# Altium project Control_Board_Model_C204.PrjPcb (part 1 of 2)
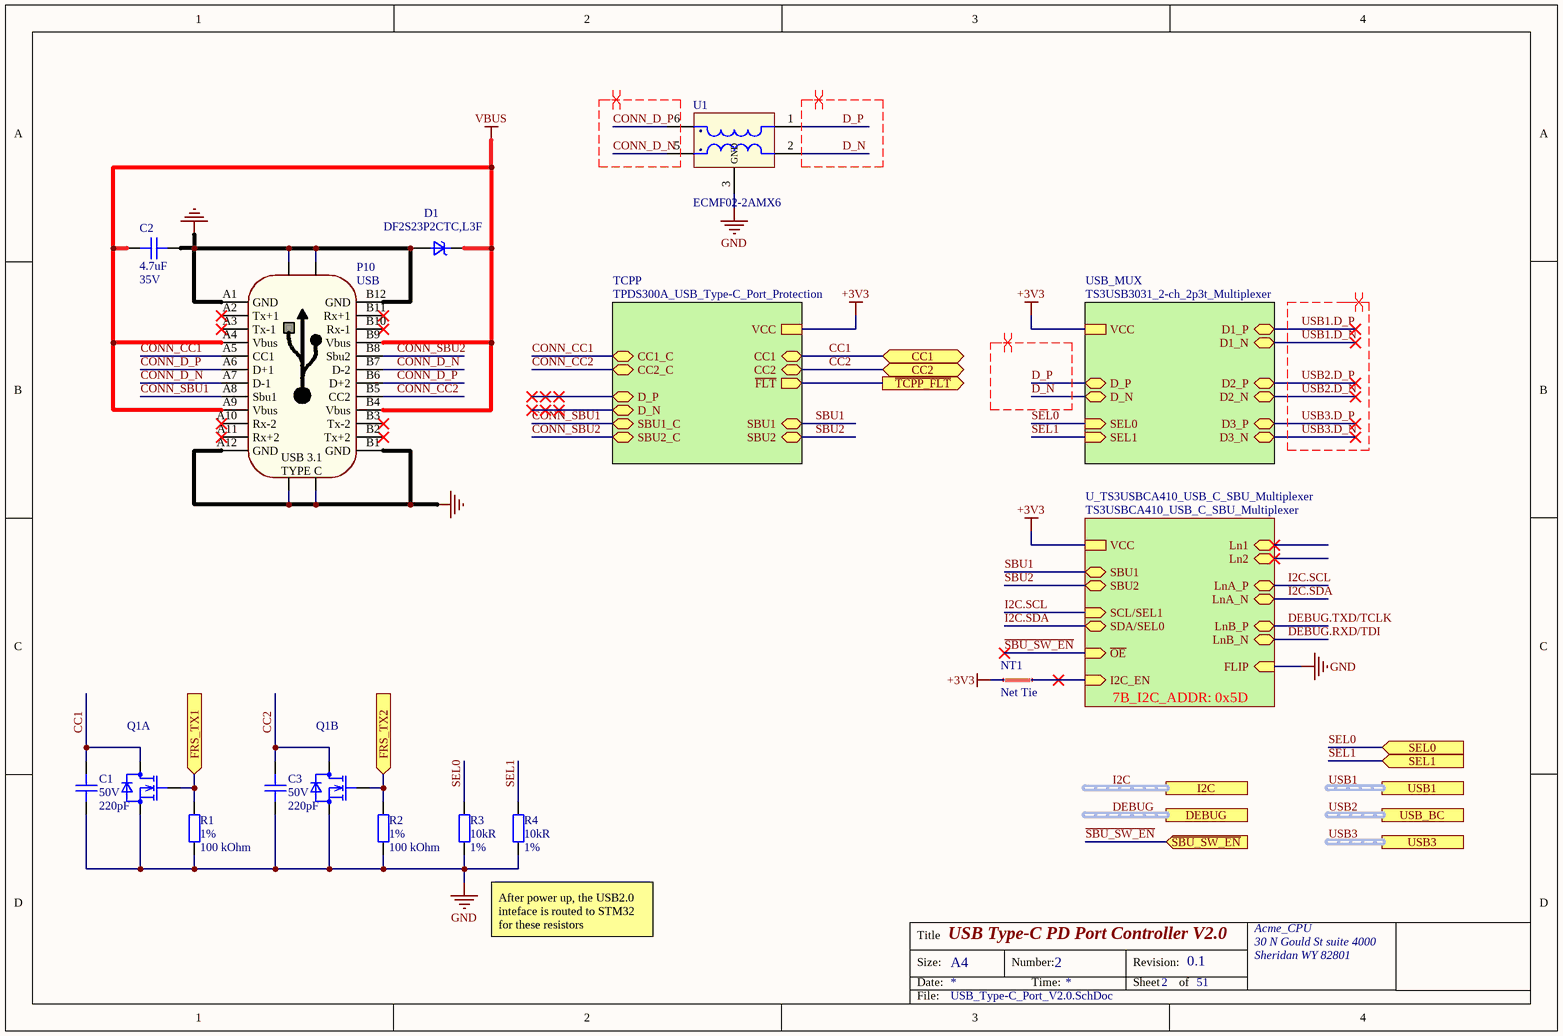
[diagram p0: USB_Type-C_Port_V2.0.SchDoc]
_address1: 30 N Gould St suite 4000; _address2: Sheridan WY 82801; _ApprovedBy: PGU; _BoardName: Control_Board; _CompanyName: Acme_CPU; _DateCode: 2022.12; _DocumentDate: 20220203; _HWEngineer: SGU; _PCBModel: C204; _PCBNumber: 001; _Revision: 0.1; _Title: Control_Board
6 sheets, 66 parts. Net scope: hierarchical (ports join the sheet entries above them; power ports are global).
Board file: Control_Board_Model_C204.PcbDoc
Sheets:
  USB_Type-C_Port_V2.0.SchDoc
  Sensor Connection.SchDoc
    TLT_SENS = BMI270_IMU.SchDoc
  Audio_Module.SchDoc
  Test_Points.SchDoc
  Analog_Signal_Conditioner_V2.SchDoc

## Sheet USB_Type-C_Port_V2.0.SchDoc: USB Type-C PD Port Controller V2.0
size A4; DocumentNumber: 2; SheetNumber: 2; SheetTotal: 51

### Parts
C1  Voltage Rating: 50V  Capacitance: 220pF  [C0402]  (hidden comment: CAP CER 220PF 50V X7R 0402)
C2  Capacitance: 4.7uF  Voltage Rating: 35V  [C0805]  (hidden comment: CAP CER 4.7UF 35V X7R 0805)
C3  Voltage Rating: 50V  Capacitance: 220pF  [C0402]  (hidden comment: CAP CER 220PF 50V X7R 0402)
D1  DF2S23P2CTC,L3F  [CST2C]
NT1  Net Tie  [Net Tie 6x30mil]  (net tie, no BOM)
P10  USB  [MOLEX_2012670005]
Q1  DMN32D2LV-7  [SON_400UV-7_DIO]  (value not drawn)  (parts A,B of 2)
R1  Tolerance: 1%  Resistance: 100 kOhm  [R0402]  (hidden comment: RES SMD 100K OHM 1% 1/16W 0402)
R2  Tolerance: 1%  Resistance: 100 kOhm  [R0402]  (hidden comment: RES SMD 100K OHM 1% 1/16W 0402)
R3  Resistance: 10kR  Tolerance: 1%  [R0402]  (hidden comment: RES SMD 10K OHM 1% 1/16W 0402)
R4  Resistance: 10kR  Tolerance: 1%  [R0402]  (hidden comment: RES SMD 10K OHM 1% 1/16W 0402)
U1  ECMF02-2AMX6  [QFN-6L]

### Sub-sheets
TCPP = TPDS300A_USB_Type-C_Port_Protection (file not in this document): ~{FLT} (out), VCC, CC1 (bidir), CC2 (bidir), CC1_C (bidir), CC2_C (bidir), SBU1_C (bidir), SBU2_C (bidir), SBU1 (bidir), SBU2 (bidir), D_P (bidir), D_N (bidir)
U_TS3USBCA410_USB_C_SBU_Multiplexer = TS3USBCA410_USB_C_SBU_Multiplexer (file not in this document): LnB_P (bidir), LnB_N (bidir), LnA_P (bidir), VCC, Ln1 (bidir), Ln2 (bidir), SBU1 (bidir), SBU2 (bidir), LnA_N (bidir), SCL/SEL1 (in), I2C_EN (in), FLIP (in), SDA/SEL0 (bidir), ~{OE} (in)  | 7B_I2C_ADDR: 0x5D
USB_MUX = TS3USB3031_2-ch_2p3t_Multiplexer (file not in this document): VCC, D_P (bidir), D_N (bidir), D1_N (bidir), D1_P (bidir), D2_P (bidir), D2_N (bidir), D3_N (bidir), D3_P (bidir), SEL0 (in), SEL1 (in)

### Ports
CC1 (bidir), CC2 (bidir), DEBUG (harness DEBUG), FRS_TX1 (in), FRS_TX2 (in), I2C (harness I2C), SEL0 (in), SEL1 (in), USB1 (harness USB), USB3 (harness USB), USB_BC (harness USB), ~{SBU_SW_EN} (in), ~{TCPP_FLT} (out)

### Nets
+3V3: NT1.1 ; sheet USB_MUX/VCC, sheet U_TS3USBCA410_USB_C_SBU_Multiplexer/VCC, sheet TCPP/VCC
GND: C1.1 C2.2 C3.1 D1.2(A) P10.A1(GND) P10.A12(GND) P10.B1(GND) P10.B12(GND) P10.S1 P10.S2 P10.S3 P10.S4 Q1.1(S) Q1.4(S) R1.1 R2.1 R3.2 R4.2 U1.3(GND) ; sheet U_TS3USBCA410_USB_C_SBU_Multiplexer/FLIP
VBUS: C2.1 D1.1(K) P10.A4(Vbus) P10.A9(Vbus) P10.B4(Vbus) P10.B9(Vbus)
~{SBU_SW_EN}: port ~{SBU_SW_EN}, sheet U_TS3USBCA410_USB_C_SBU_Multiplexer/~{OE}
CC1: C1.2 Q1.6(D) ; port CC1, sheet TCPP/CC1
CC2: C3.2 Q1.3(D) ; port CC2, sheet TCPP/CC2
CONN_CC1: P10.A5(CC1) ; sheet TCPP/CC1_C
CONN_CC2: P10.B5(CC2) ; sheet TCPP/CC2_C
CONN_D_N: P10.A7(D-1) P10.B7(D-2) U1.5(OUT2)
CONN_D_P: P10.A6(D+1) P10.B6(D+2) U1.6(OUT1)
CONN_SBU1: P10.A8(Sbu1) ; sheet TCPP/SBU1_C
CONN_SBU2: P10.B8(Sbu2) ; sheet TCPP/SBU2_C
D_N: U1.2(INP2) ; sheet USB_MUX/D_N
D_P: U1.1(INP1) ; sheet USB_MUX/D_P
DEBUG.RXD/TDI: sheet U_TS3USBCA410_USB_C_SBU_Multiplexer/LnB_N
DEBUG.TXD/TCLK: sheet U_TS3USBCA410_USB_C_SBU_Multiplexer/LnB_P
I2C.SCL: sheet U_TS3USBCA410_USB_C_SBU_Multiplexer/LnA_P, sheet U_TS3USBCA410_USB_C_SBU_Multiplexer/SCL/SEL1
I2C.SDA: sheet U_TS3USBCA410_USB_C_SBU_Multiplexer/LnA_N, sheet U_TS3USBCA410_USB_C_SBU_Multiplexer/SDA/SEL0
SBU1: sheet U_TS3USBCA410_USB_C_SBU_Multiplexer/SBU1, sheet TCPP/SBU1
SBU2: sheet U_TS3USBCA410_USB_C_SBU_Multiplexer/SBU2, sheet TCPP/SBU2
SEL0: R3.1 ; port SEL0, sheet USB_MUX/SEL0
SEL1: R4.1 ; port SEL1, sheet USB_MUX/SEL1
USB1.D_N: sheet USB_MUX/D1_N
USB1.D_P: sheet USB_MUX/D1_P
USB2.D_N: sheet USB_MUX/D2_N
USB2.D_P: sheet USB_MUX/D2_P
USB3.D_N: sheet USB_MUX/D3_N
USB3.D_P: sheet USB_MUX/D3_P
NetNT1_2: NT1.2 ; sheet U_TS3USBCA410_USB_C_SBU_Multiplexer/I2C_EN
NetQ1_2: Q1.2(G) R1.2 ; port FRS_TX1
NetQ1_5: Q1.5(G) R2.2 ; port FRS_TX2
(unnamed): port ~{TCPP_FLT}, sheet TCPP/~{FLT}

Not connected (* = marked no-connect by the designer): P10 A2(Tx+1)* A3(Tx-1)* A10(Rx-2)* A11(Rx+2)* B2(Tx+2)* B3(Tx-2)* B10(Rx-1)* B11(Rx+1)*; U1 4(NC)

### Buses and harness runs
harness DEBUG = port DEBUG
harness I2C = port I2C
harness USB1 = port USB1
harness USB2 = port USB_BC
harness USB3 = port USB3

### Layout directives
differential pair: CONN_D_N, CONN_D_P, D_N, D_P, USB1.D_N, USB1.D_P, USB2.D_N, USB2.D_P, USB3.D_N, USB3.D_P

### Notes on the sheet
- After power up, the USB2.0 inteface is routed to STM32 for these resistors
- Title
- Size:
- Date:
- A4
- Number:
- Time:
- Revision:
- Sheet
- of
- File:
- (in symbol CONN 2012670005 RCP USB3.1 TYPEC 24P SMD RA) USB 3.1; TYPE C

### Library data of the parts
C1 C3 = CAP CER 220PF 50V X7R 0402: 220pF ±10% 50V Ceramic Capacitor X7R 0402 (1005 Metric); Manufacturer: Yageo; Manufacturer Part Number: CC0402KRX7R9BB221; Insulation Resistance: 100GR; Supplier 1: Digi-Key; Stock 1: 91221; Pricing 1: 1=0.1, 10=0.026, 50=0.014, 100=0.0114, 500=0.0081, 1000=0.0064, 2500=0.0058, 5000=0.0053 (USD); Mount: Surface Mount; Case/Package: 0402; Weight: 2.3E-05oz; Case Code (Metric): 1005; Case Code (Imperial): 0402; Min Operating Temperature: -55°C; Max Operating Temperature: 125°C; Tolerance: 10%; Packaging: Tape and Reel; Package Quantity: 1; Voltage Rating (DC): 50V; Dielectric: X7R; Termination: SMD/SMT; Composition: Ceramic; Length: 1mm; Height: 0.5mm; Width: 0.02inch; Thickness: 0.022inch; Depth: 0.5mm; REACH SVHC: No SVHC; Lead Free: Lead Free; ComponentLink1URL: http://www.yageo.com/documents/recent/UPY-GPHC_X7R_6.3V-to-50V_18.pdf?src-supplier=Digi-Key; ComponentLink1Description: http://www.yageo.com/documents/recent/UPY-GPHC_X7R_6.3V-to-50V_18.pdf?src-supplier=Digi-Key; ComponentLink2URL: http://www.farnell.com/datasheets/2167236.pdf?src-supplier=Farnell; ComponentLink2Description: http://www.farnell.com/datasheets/2167236.pdf?src-supplier=Farnell; ComponentLink3URL: http://www.yageo.com/documents/recent/UPY-GPHC_X7R_6.3V-to-50V_8.pdf?src-supplier=Avnet; ComponentLink3Description: http://www.yageo.com/documents/recent/UPY-GPHC_X7R_6.3V-to-50V_8.pdf?src-supplier=Avnet; ComponentLink4URL: http://www.farnell.com/datasheets/1489800.pdf?src-supplier=Element14; ComponentLink4Description: http://www.farnell.com/datasheets/1489800.pdf?src-supplier=Element14; ComponentLink5URL: http://www.mouser.com/ds/2/447/Yageo_UPY-GP_NP0_16V-to-50V_9-358835.pdf?src-supplier=Mouser; ComponentLink5Description: http://www.mouser.com/ds/2/447/Yageo_UPY-GP_NP0_16V-to-50V_9-358835.pdf?src-supplier=Mouser; Supplier Part Number 1: 311-1035-1-ND; Number of Pins: 2; Dielectric Material: Ceramic; Radiation Hardening: No; Halogen Free: Halogen Free; ComponentLink6URL: https://www.verical.com/server-webapp/html/getDatasheet?partID=403476&src-supplier=Verical; ComponentLink6Description: https://www.verical.com/server-webapp/html/getDatasheet?partID=403476&src-supplier=Verical; ComponentLink7URL: http://www.yageo.com/documents/recent/UPY-GPHC_X7R_6.3V-to-50V_8.pdf?src-supplier=Avnet+Europe; ComponentLink7Description: http://www.yageo.com/documents/recent/UPY-GPHC_X7R_6.3V-to-50V_8.pdf?src-supplier=Avnet+Europe; ClassName: TCPP
C2 = CAP CER 4.7UF 35V X7R 0805: Manufacturer: TDK; Manufacturer Part Number: C2012X7R1V475K125AC; Dielectric Material: Ceramic; Tolerance: 10%; Supplier 1: Digi-Key; Stock 1: 109602; Pricing 1: 1=0.73, 10=0.519, 50=0.3752, 100=0.3416, 500=0.253, 1000=0.2151 (USD); Mount: Surface Mount; Case/Package: 0805; Weight: 0.000194oz; Case Code (Metric): 2012; Case Code (Imperial): 0805; Min Operating Temperature: -55°C; Max Operating Temperature: 125°C; Packaging: Tape and Reel; Package Quantity: 2000; Dielectric: X7R; Termination: SMD/SMT; Voltage Rating (DC): 35V; Length: 2mm; Height: 1.25mm; Width: 0.049inch; Thickness: 0.057inch; Depth: 1.25mm; Radiation Hardening: No; REACH SVHC: No SVHC; Lead Free: Lead Free; ComponentLink1URL: http://www.farnell.com/datasheets/2792994.pdf?src-supplier=Element14; ComponentLink1Description: http://www.farnell.com/datasheets/2792994.pdf?src-supplier=Element14; ComponentLink2URL: https://product.tdk.com/info/en/catalog/datasheets/mlcc_commercial_general_en.pdf?src-supplier=Digi-Key; ComponentLink2Description: https://product.tdk.com/info/en/catalog/datasheets/mlcc_commercial_general_en.pdf?src-supplier=Digi-Key; ComponentLink3URL: https://product.tdk.com/info/en/catalog/spec/mlccspec_commercial_general_midvoltage_en.pdf?src-supplier=Digi-Key; ComponentLink3Description: https://product.tdk.com/info/en/catalog/spec/mlccspec_commercial_general_midvoltage_en.pdf?src-supplier=Digi-Key; Supplier Part Number 1: 445-7555-1-ND
D1 = TVS DIODE 21VWM 35.7VC CST2C: 35.7V Clamp 14A (8/20µs) Ipp Tvs Diode Surface Mount CST2C; Manufacturer: Toshiba Semiconductor and Storage; Number of Unidirectional Channels: 1; Reverse Standoff Voltage: 21V; Min Breakdown Voltage: 21.5V; Peak Pulse Power: 500W; Power Line Protection: No; Supplier 1: Digi-Key; Manufacturer Part Number: DF2S23P2CTC,L3F; Stock 1: 12413; Mount: Surface Mount; Case/Package: 1610; Number of Pins: 2; Min Operating Temperature: -55°C; Max Operating Temperature: 150°C; Composition: Zener; Packaging: Tape and Reel; Clamping Voltage: 35.7V; Peak Pulse Current: 14A; ComponentLink1URL: https://www.digikey.com/en/products/detail/toshiba-semiconductor-and-storage/DF2S23P2CTC-L3F/10313036; ComponentLink1Description: https://www.digikey.com/en/products/detail/toshiba-semiconductor-and-storage/DF2S23P2CTC-L3F/10313036; Supplier Part Number 1: DF2S23P2CTCL3FTR-ND
NT1 = Net Tie Line: ClassName: Net Tie
P10 = CONN 2012670005 RCP USB3.1 TYPEC 24P SMD RA: USB-C (USB TYPE-C) USB 3.2 Gen 2 (USB 3.1 Gen 2, Superspeed + (USB 3.1)) Receptacle Connector 24 Position Surface Mount, Right Angle; Through Hole; Manufacturer: Molex; Manufacturer Part Number: 201267-0005; Number of Contacts: 24; Number of Ports: 1; Current Rating: 5A; Voltage Rating: 30V; Mating Cycles: 20000; Shielding: Shielded; Supplier 1: Digi-Key; Stock 1: 2580; Pricing 1: 1=2.34, 10=1.997, 100=1.6496 (USD); Mount: Surface Mount,Through Hole; Packaging: Tape and Reel; Connector Type: USB; Gender: Receptacle; ComponentLink1URL: https://www.molex.com/pdm_docs/sd/2012670005_sd.pdf?src-supplier=Digi-Key; ComponentLink1Description: https://www.molex.com/pdm_docs/sd/2012670005_sd.pdf?src-supplier=Digi-Key; ComponentLink2URL: http://www.farnell.com/datasheets/2722545.pdf?src-supplier=Element14; ComponentLink2Description: http://www.farnell.com/datasheets/2722545.pdf?src-supplier=Element14; Supplier Part Number 1: WM17992CT-ND; Contact Plating: Gold; Insulation Color: Black; Min Operating Temperature: -40°C; Max Operating Temperature: 105°C; Termination: Solder; Flammability Rating: UL94 V-0; ComponentLink3URL: http://www.farnell.com/datasheets/2722545.pdf?src-supplier=Newark; ComponentLink3Description: http://www.farnell.com/datasheets/2722545.pdf?src-supplier=Newark; ComponentLink4URL: https://www.molex.com/pdm_docs/pk/2012670005-PK1.pdf?src-supplier=Digi-Key; ComponentLink4Description: https://www.molex.com/pdm_docs/pk/2012670005-PK1.pdf?src-supplier=Digi-Key; ComponentLink5URL: http://www.farnell.com/datasheets/2722545.pdf?src-supplier=Farnell; ComponentLink5Description: http://www.farnell.com/datasheets/2722545.pdf?src-supplier=Farnell
Q1 = ARRAY MOSFET 2N-CH 30V 0.4A SOT-563: Mosfet Array 2 N-Channel (Dual) 30V 400mA 400mW Surface Mount SOT-563; Manufacturer: Diodes; Gate to Source Voltage (Vgs): 10V; Rds On Max: 1.2R; Input Capacitance: 39pF; Number of Channels: 2; Supplier 1: Digi-Key; Manufacturer Part Number: DMN32D2LV-7; Stock 1: 141366; Pricing 1: 1=0.39, 10=0.338, 25=0.3152, 100=0.234, 500=0.1827, 1000=0.1485 (USD); Mount: Surface Mount; Min Operating Temperature: -55°C; Max Operating Temperature: 150°C; Continuous Drain Current (ID): 400mA; Package Quantity: 3000; Packaging: Tape and Reel; Drain to Source Voltage (Vdss): 30V; Max Power Dissipation: 400mW; Drain to Source Breakdown Voltage: 30V; Drain to Source Resistance: 1.2R; Element Configuration: Dual; FET Type: 2 N-Channel; Length: 1.6mm; Height: 0.6mm; Width: 1.2mm; Radiation Hardening: No; REACH SVHC: No SVHC; ComponentLink1URL: https://www.diodes.com/assets/Datasheets/ds31121.pdf?src-supplier=Digi-Key; ComponentLink1Description: https://www.diodes.com/assets/Datasheets/ds31121.pdf?src-supplier=Digi-Key; ComponentLink2URL: http://www.mouser.com/ds/2/115/ds31121-89496.pdf?src-supplier=Mouser; ComponentLink2Description: http://www.mouser.com/ds/2/115/ds31121-89496.pdf?src-supplier=Mouser; ComponentLink3URL: http://www.diodes.com///datasheets/ds31121.pdf?src-supplier=Avnet; ComponentLink3Description: http://www.diodes.com///datasheets/ds31121.pdf?src-supplier=Avnet; Supplier Part Number 1: DMN32D2LV-7DICT-ND; Case/Package: SOT-563; Weight: 0.000106oz; Polarity: N-CHANNEL; Series: -; ClassName: TCPP
R1 R2 = RES SMD 100K OHM 1% 1/16W 0402: 100 kOhms ±1% 0.063W, 1/16W Chip Resistor 0402 (1005 Metric) Moisture Resistant Thick Film; Manufacturer: Yageo; Manufacturer Part Number: RC0402FR-07100KL; Temperature Coefficient: 100ppm/°C; Power Rating: 63mW; Voltage Rating: 50V; Supplier 1: Digi-Key; Stock 1: 47448883; Pricing 1: 1=0.1, 10=0.016, 100=0.0064, 1000=0.0029, 2500=0.0025, 5000=0.0021 (USD); Case Code (Metric): 1005; Case Code (Imperial): 0402; Min Operating Temperature: -55°C; Max Operating Temperature: 155°C; Composition: Thick Film; Packaging: Tape and Reel; Package Quantity: 1; Number of Terminations: 2; Termination: SMD/SMT; Military Standard: Not; Max Power Dissipation: 63mW; Working Voltage: 50V; Features: Moisture Resistant; Length: 0.039inch; Height: 0.016inch; Width: 0.02inch; Depth: 0.5mm; REACH SVHC: No SVHC; Lead Free: Lead Free; ComponentLink1URL: http://www.yageo.com/documents/recent/PYu-RC_Group_51_RoHS_L_10.pdf?src-supplier=Digi-Key; ComponentLink1Description: http://www.yageo.com/documents/recent/PYu-RC_Group_51_RoHS_L_10.pdf?src-supplier=Digi-Key; ComponentLink2URL: http://www.farnell.com/datasheets/1018594.pdf?src-supplier=Element14; ComponentLink2Description: http://www.farnell.com/datasheets/1018594.pdf?src-supplier=Element14; ComponentLink3URL: http://www.yageo.com/documents/recent/PYu-RC_Group_51_RoHS_L_9.pdf?src-supplier=Verical; ComponentLink3Description: http://www.yageo.com/documents/recent/PYu-RC_Group_51_RoHS_L_9.pdf?src-supplier=Verical; ComponentLink4URL: http://www.yageo.com/documents/recent/PYu-RC_Group_51_RoHS_L_9.pdf?src-supplier=Mouser; ComponentLink4Description: http://www.yageo.com/documents/recent/PYu-RC_Group_51_RoHS_L_9.pdf?src-supplier=Mouser; ComponentLink5URL: http://documents.rs-components.com/techlib://itc_doclist_GB.htm?stockno=6185797&src-supplier=RSComponents; ComponentLink5Description: http://documents.rs-components.com/techlib://itc_doclist_GB.htm?stockno=6185797&src-supplier=RSComponents; Supplier Part Number 1: 311-100KLRDKR-ND; Case/Package: 0402; ClassName: TCPP; Mount: Surface Mount
R3 R4 = RES SMD 10K OHM 1% 1/16W 0402: 10 kOhms ±1% 0.063W, 1/16W Chip Resistor 0402 (1005 Metric) Moisture Resistant Thick Film; Manufacturer: Yageo; Manufacturer Part Number: RC0402FR-0710KP; Max Power Dissipation: 63mW; Temperature Coefficient: 150ppm/°C; Supplier 1: Digi-Key; Stock 1: 839368; Pricing 1: 1=0.1, 10=0.035, 100=0.014, 1000=0.0063, 2500=0.0055, 5000=0.0045 (USD); Case/Package: 0402; Case Code (Metric): 1005; Case Code (Imperial): 0402; Min Operating Temperature: -55°C; Max Operating Temperature: 155°C; Packaging: Tape and Reel; Composition: Thick Film; Number of Terminations: 2; Features: Moisture Resistant; Length: 0.039inch; Height: 0.016inch; Width: 0.02inch; ComponentLink1URL: http://www.yageo.com/NewPortal/yageodocoutput?fileName=/pdf/R-Chip/PYu-RC_51_RoHS_P_0.pdf&src-supplier=Digi-Key; ComponentLink1Description: http://www.yageo.com/NewPortal/yageodocoutput?fileName=/pdf/R-Chip/PYu-RC_51_RoHS_P_0.pdf&src-supplier=Digi-Key; Supplier Part Number 1: YAG1249CT-ND; ClassName: USB_MUX; Mount: Surface Mount
U1 = CMC 200MA 2LN SMD ESD: 2 Line Common Mode Choke Surface Mount  200mA DCR 2.5Ohm; Manufacturer: STMicroelectronics; Number of Lines: 2; DC Resistance (DCR): 2.5R; Supplier 1: Digi-Key; Manufacturer Part Number: ECMF02-2AMX6; Stock 1: 23653; Pricing 1: 1=0.48, 10=0.418, 25=0.3888, 50=0.3288, 100=0.2989, 250=0.281, 500=0.2511, 1000=0.2033 (USD); Mount: Surface Mount; Case/Package: QFN; Number of Pins: 6; Min Operating Temperature: -40°C; Max Operating Temperature: 85°C; Packaging: Tape and Reel; Package Quantity: 1; Current: 200mA; Termination: Flat; Max Current Rating: 200mA; Current Rating: 200mA; Length: 1.75mm; Height: 0.022inch; Width: 0.059inch; Depth: 1.55mm; Radiation Hardening: No; Lead Free: Lead Free; REACH SVHC: No SVHC; ComponentLink1URL: http://www.st.com/web/en/resource/technical/document/datasheet/CD00282307.pdf?src-supplier=Future+Electronics; ComponentLink1Description: http://www.st.com/web/en/resource/technical/document/datasheet/CD00282307.pdf?src-supplier=Future+Electronics; ComponentLink2URL: http://www.st.com/content/ccc/resource/technical/document/datasheet/3a/28/cf/d0/31/63/48/8c/CD00282307.pdf/files/CD00282307.pdf/jcr:content/translations/en.CD00282307.pdf?src-supplier=Digi-Key; ComponentLink2Description: http://www.st.com/content/ccc/resource/technical/document/datasheet/3a/28/cf/d0/31/63/48/8c/CD00282307.pdf/files/CD00282307.pdf/jcr:content/translations/en.CD00282307.pdf?src-supplier=Digi-Key; ComponentLink3URL: http://www.mouser.com/ds/2/389/ecmf02-2amx6-954491.pdf?src-supplier=Mouser; ComponentLink3Description: http://www.mouser.com/ds/2/389/ecmf02-2amx6-954491.pdf?src-supplier=Mouser; ComponentLink4URL: https://www.verical.com/server-webapp/html/getDatasheet?partID=259862&src-supplier=Verical; ComponentLink4Description: https://www.verical.com/server-webapp/html/getDatasheet?partID=259862&src-supplier=Verical; Supplier Part Number 1: 497-10773-1-ND

## Sheet Sensor Connection.SchDoc: Sensor Connection
size A4; DocumentNumber: 13; SheetNumber: 13; SheetTotal: 51
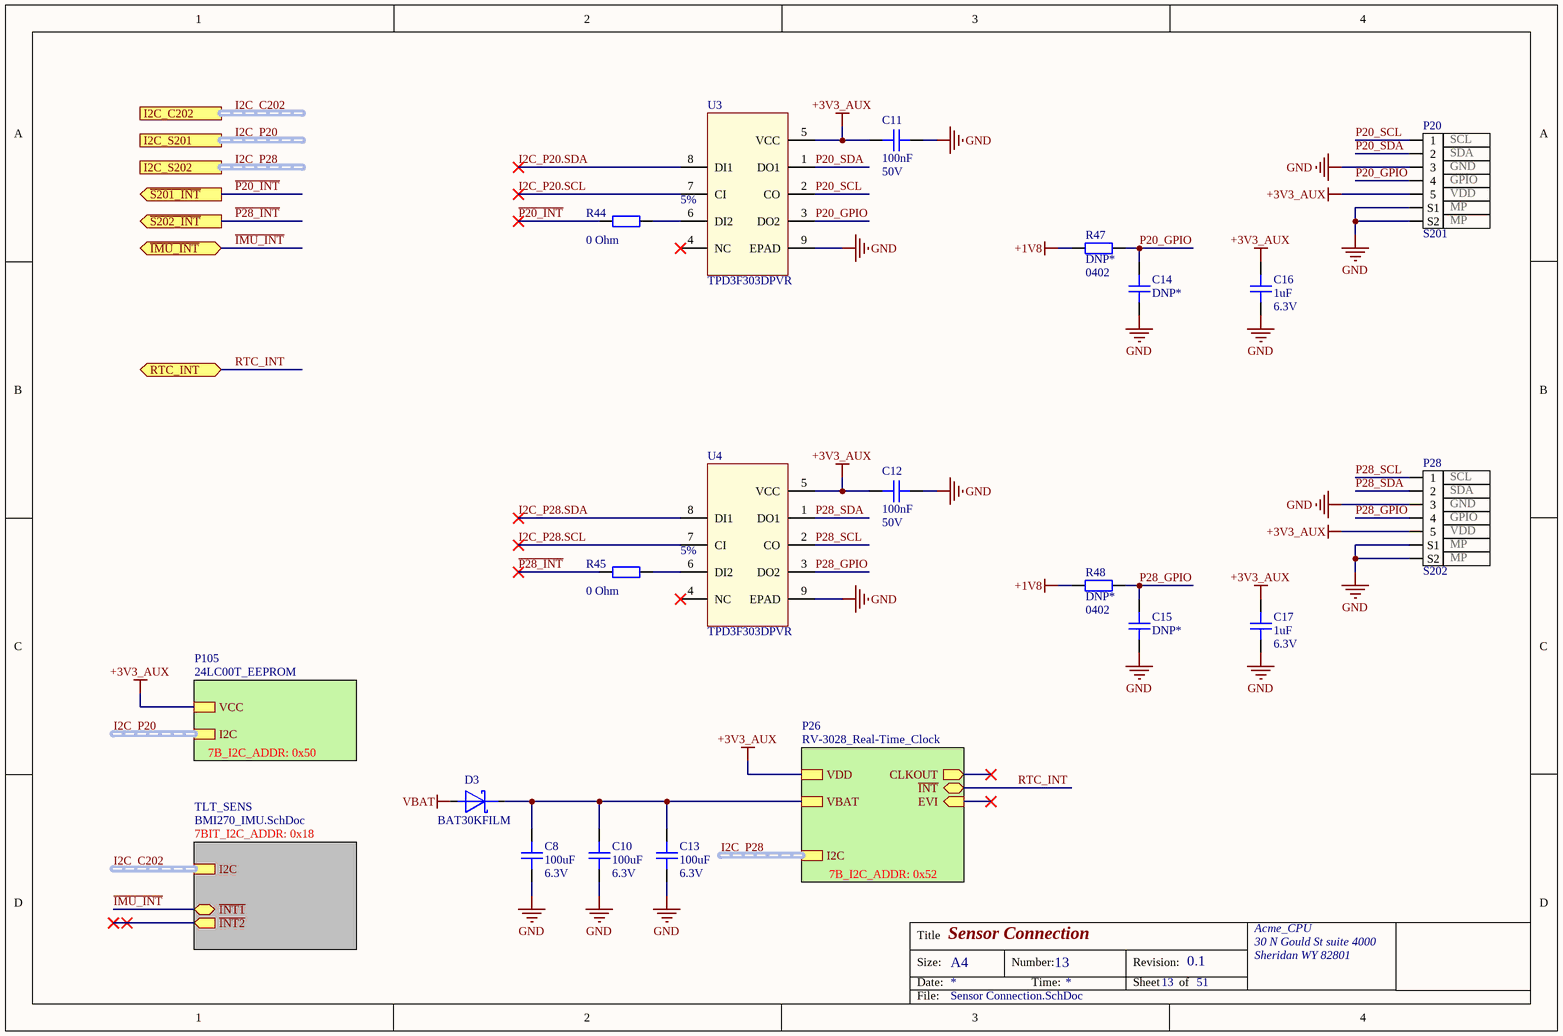
[diagram p1: Sensor Connection.SchDoc]

### Parts
C8  Capacitance: 100uF  Voltage Rating: 6.3V  [C0805]  (hidden comment: CAP CER 100UF 6.3V X5R 0805)
C10  Capacitance: 100uF  Voltage Rating: 6.3V  [C0805]  (hidden comment: CAP CER 100UF 6.3V X5R 0805)
C11  Capacitance: 100nF  Voltage: 50V  [C0402]  (hidden comment: CAP CER 0.1UF 50V X7R 0402)
C12  Capacitance: 100nF  Voltage: 50V  [C0402]  (hidden comment: CAP CER 0.1UF 50V X7R 0402)
C13  Capacitance: 100uF  Voltage Rating: 6.3V  [C0805]  (hidden comment: CAP CER 100UF 6.3V X5R 0805)
C14  DNP*  [C0402]  (no BOM)
C15  DNP*  [C0402]  (no BOM)
C16  Capacitance: 1uF  Voltage Rating: 6.3V  [C0402]  (hidden comment: CAP CER 1UF 6.3V X5R 0402)
C17  Capacitance: 1uF  Voltage Rating: 6.3V  [C0402]  (hidden comment: CAP CER 1UF 6.3V X5R 0402)
D3  BAT30KFILM  [SOD-523]
P20  S201  pin_1: SCL  pin_2: SDA  pin_3: GND  pin_4: GPIO  pin_5: VDD  pin_MP1: MP  [CONN_0545500571]
P28  S202  pin_1: SCL  pin_2: SDA  pin_3: GND  pin_4: GPIO  pin_5: VDD  pin_MP1: MP  [CONN_0545500571]
R44  Tolerance: 5%  Resistance: 0 Ohm  [R0402]  (hidden comment: RES SMD 0 OHM JUMPER 1/16W 0402)
R45  Tolerance: 5%  Resistance: 0 Ohm  [R0402]  (hidden comment: RES SMD 0 OHM JUMPER 1/16W 0402)
R47  DNP*  Case/Package: 0402  [R0402]  (no BOM)
R48  DNP*  Case/Package: 0402  [R0402]  (no BOM)
U3  TPD3F303DPVR  [DPV8_1P7X0P4]
U4  TPD3F303DPVR  [DPV8_1P7X0P4]

### Sub-sheets
P26 = RV-3028_Real-Time_Clock (file not in this document): I2C (harness I2C), EVI (in), CLKOUT (out), ~{INT} (bidir), VDD, VBAT  | 7B_I2C_ADDR: 0x52
P105 = 24LC00T_EEPROM (file not in this document): I2C (harness I2C), VCC  | 7B_I2C_ADDR: 0x50
TLT_SENS = BMI270_IMU.SchDoc: ~{INT2} (out), ~{INT1} (bidir), I2C (harness I2C)  | 7BIT_I2C_ADDR: 0x18

### Ports
I2C_C202 (harness I2C), I2C_S201 (harness I2C), I2C_S202 (harness I2C), RTC_INT (bidir), ~{IMU_INT} (bidir), ~{S201_INT} (out), ~{S202_INT} (out)

### Nets
+1V8: R47.2 R48.2
+3V3_AUX: C11.1 C12.1 C16.2 C17.2 P20.5 P28.5 U3.5(VCC) U4.5(VCC) ; sheet P105/VCC, sheet P26/VDD
GND: C8.1 C10.1 C11.2 C12.2 C13.1 C14.1 C15.1 C16.1 C17.1 P20.0(S1) P20.3 P28.0(S1) P28.3 U3.9(EPAD) U4.9(EPAD)
VBAT: D3.2(A)
~{IMU_INT}: port ~{IMU_INT}, sheet TLT_SENS/~{INT1}
~{P20_INT}: R44.1 ; port ~{S201_INT}
~{P28_INT}: R45.1 ; port ~{S202_INT}
I2C_P20.SCL: U3.7(CI)
I2C_P20.SDA: U3.8(DI1)
I2C_P28.SCL: U4.7(CI)
I2C_P28.SDA: U4.8(DI1)
P20_GPIO: C14.2 P20.4 R47.1 U3.3(DO2)
P20_SCL: P20.1 U3.2(CO)
P20_SDA: P20.2 U3.1(DO1)
P28_GPIO: C15.2 P28.4 R48.1 U4.3(DO2)
P28_SCL: P28.1 U4.2(CO)
P28_SDA: P28.2 U4.1(DO1)
RTC_INT: port RTC_INT, sheet P26/~{INT}
NetC8_2: C8.2 C10.2 C13.2 D3.1(K) ; sheet P26/VBAT
NetR44_2: R44.2 U3.6(DI2)
NetR45_2: R45.2 U4.6(DI2)

Not connected (* = marked no-connect by the designer): U3 4(NC)*; U4 4(NC)*

### Buses and harness runs
harness I2C_C202 = port I2C_C202
harness I2C_C202 = sheet TLT_SENS/I2C
harness I2C_P20 = port I2C_S201
harness I2C_P20 = sheet P105/I2C
harness I2C_P28 = port I2C_S202
harness I2C_P28 = sheet P26/I2C

### Notes on the sheet
- Title
- Size:
- Date:
- A4
- Number:
- Time:
- Revision:
- Sheet
- of
- File:

### Library data of the parts
C8 C10 C13 = CAP CER 100UF 6.3V X5R 0805: 100 µF ±20% 6.3V Ceramic Capacitor X5R 0805 (2012 Metric); Manufacturer: CAL-CHIP ELECTRONICS, INC.; Manufacturer Part Number: GMC21X5R107M6R3NT; Supplier 1: Digi-Key; Stock 1: 3990; Pricing 1: 1=0.49, 10=0.348, 50=0.2632, 100=0.2293, 500=0.1698, 1000=0.1444 (USD); Mount: Surface Mount; Case/Package: 0805; Weight: 0.000571oz; Case Code (Imperial): 0805; Case Code (Metric): 2012; Min Operating Temperature: -55°C; Max Operating Temperature: 85°C; Tolerance: 20%; Packaging: Tape and Reel; Voltage Rating (DC): 6.3V; Dielectric: X5R; Termination: SMD/SMT; Composition: Ceramic; Length: 2mm; Width: 1.25mm; Thickness: 0.071inch; Depth: 1.5mm; Radiation Hardening: No; Lead Free: Lead Free; Halogen Free: Halogen Free; ComponentLink1URL: https://www.digikey.com/en/products/detail/cal-chip-electronics-inc/GMC21X5R107M6R3NT/12140431; ComponentLink1Description: https://www.digikey.com/en/products/detail/cal-chip-electronics-inc/GMC21X5R107M6R3NT/12140431; Supplier Part Number 1: 2571-GMC21X5R107M6R3NTTR-ND
C11 C12 = CAP CER 0.1UF 50V X7R 0402: 0.1µF ±10% 50V Ceramic Capacitor X7R 0402 (1005 Metric); Manufacturer: TDK; Manufacturer Part Number: CGA2B3X7R1H104K050BB; Supplier 1: Digi-Key; Stock 1: 2925303; Pricing 1: 1=0.17, 10=0.118, 50=0.0668, 100=0.0553, 500=0.0388, 1000=0.0321, 2500=0.0299, 5000=0.0273 (USD); Mount: Surface Mount; Case/Package: 0402; Weight: 2.3E-05oz; Case Code (Metric): 1005; Case Code (Imperial): 0402; Min Operating Temperature: -55°C; Max Operating Temperature: 125°C; Voltage Rating: 50V; Tolerance: 10%; Packaging: Tape and Reel; Package Quantity: 1; Voltage Rating (DC): 50V; Dielectric: X7R; Termination: SMD/SMT; Composition: Ceramic; Length: 1mm; Height: 0.5mm; Width: 0.02inch; Thickness: 0.022inch; Depth: 0.5mm; Ratings: AEC-Q200; REACH SVHC: No SVHC; Lead Free: Lead Free; ComponentLink1URL: http://product.tdk.com/capacitor/mlcc/en/documents/mlccspec_automotive_general_midvoltage_en.pdf?src-supplier=Future+Electronics; ComponentLink1Description: http://product.tdk.com/capacitor/mlcc/en/documents/mlccspec_automotive_general_midvoltage_en.pdf?src-supplier=Future+Electronics; ComponentLink2URL: http://www.farnell.com/datasheets/1807242.pdf?src-supplier=Element14; ComponentLink2Description: http://www.farnell.com/datasheets/1807242.pdf?src-supplier=Element14; ComponentLink3URL: http://www.mouser.com/ds/2/400/lcc_automotive_general_en-843974.pdf?src-supplier=Mouser; ComponentLink3Description: http://www.mouser.com/ds/2/400/lcc_automotive_general_en-843974.pdf?src-supplier=Mouser; ComponentLink4URL: http://www.farnell.com/datasheets/1936565.pdf?src-supplier=Element14; ComponentLink4Description: http://www.farnell.com/datasheets/1936565.pdf?src-supplier=Element14; ComponentLink5URL: http://www.farnell.com/datasheets/1735392.pdf?src-supplier=Element14; ComponentLink5Description: http://www.farnell.com/datasheets/1735392.pdf?src-supplier=Element14; Supplier Part Number 1: 445-6899-1-ND
C14 C15 = CAP CER NO_BOM 0402: Placeholder for a 0402 capacitor
C16 C17 = CAP CER 1UF 6.3V X5R 0402: 1µF ±10% 6.3V Ceramic Capacitor X5R 0402 (1005 Metric); Manufacturer: Yageo; Manufacturer Part Number: CC0402KRX5R5BB105; Supplier 1: Digi-Key; Stock 1: 34926286; Pricing 1: 1=0.1, 10=0.05, 50=0.0272, 100=0.0222, 500=0.0158, 1000=0.0124, 2500=0.0113, 5000=0.0104 (USD); Mount: Surface Mount; Number of Pins: 2; Case Code (Imperial): 0402; Case Code (Metric): 1005; Min Operating Temperature: -55°C; Max Operating Temperature: 85°C; Tolerance: 10%; Packaging: Tape and Reel; Termination: SMD/SMT; Voltage Rating (DC): 6.3V; Composition: Ceramic; Length: 1mm; Height: 0.5mm; Width: 0.02inch; Thickness: 0.022inch; Depth: 0.5mm; Radiation Hardening: No; Lead Free: Lead Free; Halogen Free: Halogen Free; ComponentLink1URL: http://www.farnell.com/datasheets/70765.pdf?src-supplier=Farnell; ComponentLink1Description: http://www.farnell.com/datasheets/70765.pdf?src-supplier=Farnell; Supplier Part Number 1: 311-1438-1-ND; Dielectric: X5R; Case/Package: 0402; Dielectric Material: Ceramic; Package Quantity: 1; REACH SVHC: No SVHC; ComponentLink2URL: http://www.yageo.com/documents/recent/UPY-GPHC_X5R_4V-to-50V_25.pdf?src-supplier=Digi-Key; ComponentLink2Description: http://www.yageo.com/documents/recent/UPY-GPHC_X5R_4V-to-50V_25.pdf?src-supplier=Digi-Key; ComponentLink3URL: http://www.farnell.com/datasheets/2167237.pdf?src-supplier=Element14; ComponentLink3Description: http://www.farnell.com/datasheets/2167237.pdf?src-supplier=Element14; ComponentLink4URL: http://www.yageo.com/documents/recent/UPY-GPHC_X5R_4V-to-50V_12.pdf?src-supplier=Avnet+Europe; ComponentLink4Description: http://www.yageo.com/documents/recent/UPY-GPHC_X5R_4V-to-50V_12.pdf?src-supplier=Avnet+Europe; ComponentLink5URL: http://www.farnell.com/datasheets/1359354.pdf?src-supplier=Element14; ComponentLink5Description: http://www.farnell.com/datasheets/1359354.pdf?src-supplier=Element14; ComponentLink6URL: http://www.farnell.com/datasheets/70765.pdf?src-supplier=Element14; ComponentLink6Description: http://www.farnell.com/datasheets/70765.pdf?src-supplier=Element14; ComponentLink7URL: http://www.yageo.com/documents/recent/UPY-GPHC_X5R_4V-to-50V_12.pdf?src-supplier=Avnet; ComponentLink7Description: http://www.yageo.com/documents/recent/UPY-GPHC_X5R_4V-to-50V_12.pdf?src-supplier=Avnet
D3 = DIODE SCHOTTKY 30V 300MA SOD523: Diode Schottky 30 V 300mA (DC) Surface Mount SOD-523; Manufacturer: STMicroelectronics; Forward Voltage: 530mV; Max Power Dissipation: 100mW; Max Repetitive Reverse Voltage (Vrrm): 30V; Element Configuration: Single; Supplier 1: Digi-Key; Manufacturer Part Number: BAT30KFILM; Stock 1: 28802; Case/Package: SOD-523; Number of Pins: 2; Contact Plating: Tin,Matte; Min Operating Temperature: -55°C; Max Operating Temperature: 125°C; Forward Current: 300mA; Package Quantity: 1; Packaging: Tape and Reel; Average Rectified Current: 300mA; Power Dissipation: 100mW; Termination: SMD/SMT; Max Reverse Voltage (DC): 30V; Lead Free: Lead Free; ComponentLink1URL: https://www.digikey.com/en/products/detail/stmicroelectronics/BAT30KFILM/1207019?s=N4IgTCBcDaIEIEEAqBmADAaQGIEkAyAsiALoC%2BQA; ComponentLink1Description: https://www.digikey.com/en/products/detail/stmicroelectronics/BAT30KFILM/1207019?s=N4IgTCBcDaIEIEEAqBmADAaQGIEkAyAsiALoC%2BQA; Supplier Part Number 1: 497-5552-1-ND; Mount: Surface Mount
P20 P28 = CONN FFC FPC TOP 5POS 0.50MM R/A: 5 Position FFC, FPC Connector Contacts, Top 0.020" (0.50mm) Surface Mount, Right Angle; Manufacturer: Molex; Manufacturer Part Number: 0545500571; Actuator Material: Polyphenylene; Current Rating: 500mA; Voltage Rating: 50V; Number of Positions: 5; Contact Resistance: 40mR; Wire/Cable Type: Straight; Pitch: 0.02inch; Supplier 1: Digi-Key; Stock 1: 20865; Pricing 1: 1=0.98, 10=0.808, 100=0.673, 1000=0.5384 (USD); Mount: Surface Mount; Contact Material: Bronze; Contact Plating: Gold; Housing Material: Polymer; Min Operating Temperature: -20°C; Max Operating Temperature: 85°C; Package Quantity: 1; Packaging: Tape and Reel; Number of Rows: 1; Termination: Solder; Orientation: Right Angle; Length: 7.7mm; Depth: 5mm; Radiation Hardening: No; Flammability Rating: UL94 V-0; ComponentLink1URL: http://www.molex.com/webdocs/datasheets/pdf/en-us/0545500571_FFC_FPC_CONNECTORS.pdf?src-supplier=Avnet; ComponentLink1Description: http://www.molex.com/webdocs/datasheets/pdf/en-us/0545500571_FFC_FPC_CONNECTORS.pdf?src-supplier=Avnet; Supplier Part Number 1: WM8824CT-ND; pin_MP2: MP
R44 R45 = RES SMD 0 OHM JUMPER 1/16W 0402: 0 Ohms Jumper 0.063W, 1/16W Chip Resistor 0402 (1005 Metric) Moisture Resistant Thick Film; Manufacturer: Yageo; Manufacturer Part Number: RC0402JR-070RL; Power Rating: 62.5mW; Voltage Rating: 50V; Max Power Dissipation: 63mW; Temperature Coefficient: 200ppm/°C; Supplier 1: Digi-Key; Stock 1: 46057148; Pricing 1: 1=0.1, 10=0.013, 25=0.0092, 50=0.0072, 100=0.0053, 250=0.004, 500=0.0032, 1000=0.0024, 5000=0.0017 (USD); Contact Plating: Tin,Matte; Case Code (Metric): 1005; Case Code (Imperial): 0402; Min Operating Temperature: -55°C; Max Operating Temperature: 155°C; Packaging: Tape and Reel; Composition: Thick Film; Package Quantity: 1; Number of Terminations: 2; Termination: SMD/SMT; Military Standard: Not; Features: Moisture Resistant; Length: 1mm; Height: 0.016inch; Width: 0.02inch; Depth: 0.5mm; Radiation Hardening: No; REACH SVHC: Unknown; Lead Free: Lead Free; ComponentLink1URL: http://www.yageo.com/documents/recent/PYu-RC_Group_51_RoHS_L_10.pdf?src-supplier=Digi-Key; ComponentLink1Description: http://www.yageo.com/documents/recent/PYu-RC_Group_51_RoHS_L_10.pdf?src-supplier=Digi-Key; ComponentLink2URL: http://www.yageo.com/documents/recent/PYu-RC0402_51_RoHS_L_6.pdf?src-supplier=Avnet+Europe; ComponentLink2Description: http://www.yageo.com/documents/recent/PYu-RC0402_51_RoHS_L_6.pdf?src-supplier=Avnet+Europe; ComponentLink3URL: http://www.farnell.com/datasheets/1018594.pdf?src-supplier=Element14; ComponentLink3Description: http://www.farnell.com/datasheets/1018594.pdf?src-supplier=Element14; ComponentLink4URL: https://www.verical.com/server-webapp/html/getDatasheet?partID=326379&src-supplier=Verical; ComponentLink4Description: https://www.verical.com/server-webapp/html/getDatasheet?partID=326379&src-supplier=Verical; ComponentLink5URL: http://www.farnell.com/datasheets/2167052.pdf?src-supplier=Element14; ComponentLink5Description: http://www.farnell.com/datasheets/2167052.pdf?src-supplier=Element14; Supplier Part Number 1: 311-0.0JRCT-ND; Case/Package: 0402; Mount: Surface Mount
R47 R48 = RES SMD NO BOM 0402: Placeholder for a 0402 resistor
U3 U4 = FILTER RC(PI) ESD SMD  8-UFDFN EP: RC (Pi) EMI Filter 2nd Order Low Pass 3 Channel R = 47Ohms, 100Ohms, C = 20pF  8-UFDFN Exposed Pad; Manufacturer: Texas Instruments; Number of Channels: 3; Operating Supply Voltage: 5.5V; ESD Protection: Yes; Clamping Voltage: 10V; Frequency: 308MHz; Supplier 1: Digi-Key; Manufacturer Part Number: TPD3F303DPVR; Stock 1: 4896; Pricing 1: 1=0.85, 10=0.812, 25=0.7856, 50=0.6414, 100=0.576, 250=0.5236, 500=0.4974, 1000=0.4451 (USD); Case/Package: SMD/SMT; Number of Pins: 8; Contact Plating: Gold; Min Operating Temperature: -40°C; Max Operating Temperature: 85°C; Package Quantity: 1; Packaging: Tape and Reel; Capacitance: 20pF; Termination: Flat; Length: 2.2mm; Height: 0.026inch; Width: 0.063inch; Depth: 1.7mm; Radiation Hardening: No; REACH SVHC: No SVHC; Lead Free: Lead Free; ComponentLink1URL: http://www.ti.com/lit/ds/symlink/tpd3f303.pdf?src-supplier=Digi-Key; ComponentLink1Description: http://www.ti.com/lit/ds/symlink/tpd3f303.pdf?src-supplier=Digi-Key; ComponentLink2URL: http://focus.ti.com/lit/ds/symlink/tpd3f303.pdf?src-supplier=Avnet+Europe; ComponentLink2Description: http://focus.ti.com/lit/ds/symlink/tpd3f303.pdf?src-supplier=Avnet+Europe; ComponentLink3URL: https://www.verical.com/server-webapp/html/getDatasheet?partID=302817&src-supplier=Verical; ComponentLink3Description: https://www.verical.com/server-webapp/html/getDatasheet?partID=302817&src-supplier=Verical; ComponentLink4URL: http://www.farnell.com/datasheets/1558442.pdf?src-supplier=Element14; ComponentLink4Description: http://www.farnell.com/datasheets/1558442.pdf?src-supplier=Element14; Supplier Part Number 1: 296-28299-1-ND; Mount: Surface Mount

## Sheet BMI270_IMU.SchDoc: BMA253 Orientation Sensor
size A4; DocumentNumber: 21; SheetNumber: 21; SheetTotal: 51
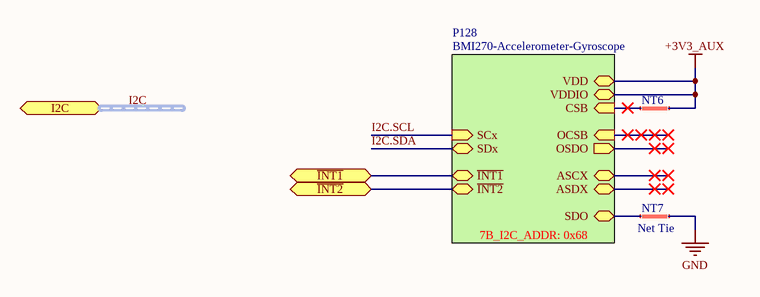
[diagram p2: BMI270_IMU.SchDoc]

### Parts
NT6  Net Tie  [Net Tie 6x30mil]  (value not drawn)  (net tie, no BOM)
NT7  Net Tie  [Net Tie 6x30mil]  (net tie, no BOM)

### Sub-sheets
P128 = BMI270-Accelerometer-Gyroscope (file not in this document): SCx (in), SDx (bidir), VDD, VDDIO, ~{INT1} (bidir), ~{INT2} (bidir), SDO (bidir), ASCX (bidir), ASDX (bidir), OCSB (in), OSDO (out), CSB (in)  | 7B_I2C_ADDR: 0x68

### Ports
I2C (harness I2C), ~{INT1} (bidir), ~{INT2} (bidir)

### Nets
+3V3_AUX: NT6.2 ; sheet P128/VDD, sheet P128/VDDIO
GND: NT7.2
~{IMU_INT}: port ~{INT1}, sheet P128/~{INT1}
I2C.SCL: sheet P128/SCx
I2C.SDA: sheet P128/SDx
NetNT6_1: NT6.1 ; sheet P128/CSB
NetNT7_1: NT7.1 ; sheet P128/SDO
(unnamed): port ~{INT2}, sheet P128/~{INT2}

### Buses and harness runs
harness I2C = port I2C

### Notes on the sheet
- Title
- Size:
- Date:
- A4
- Number:
- Time:
- Revision:
- Sheet
- of
- File:

### Library data of the parts
NT6 NT7 = Net Tie Line: ClassName: P128

## Sheet Audio_Module.SchDoc: Audio Module
size A4; DocumentNumber: 9; SheetNumber: 9; SheetTotal: 51
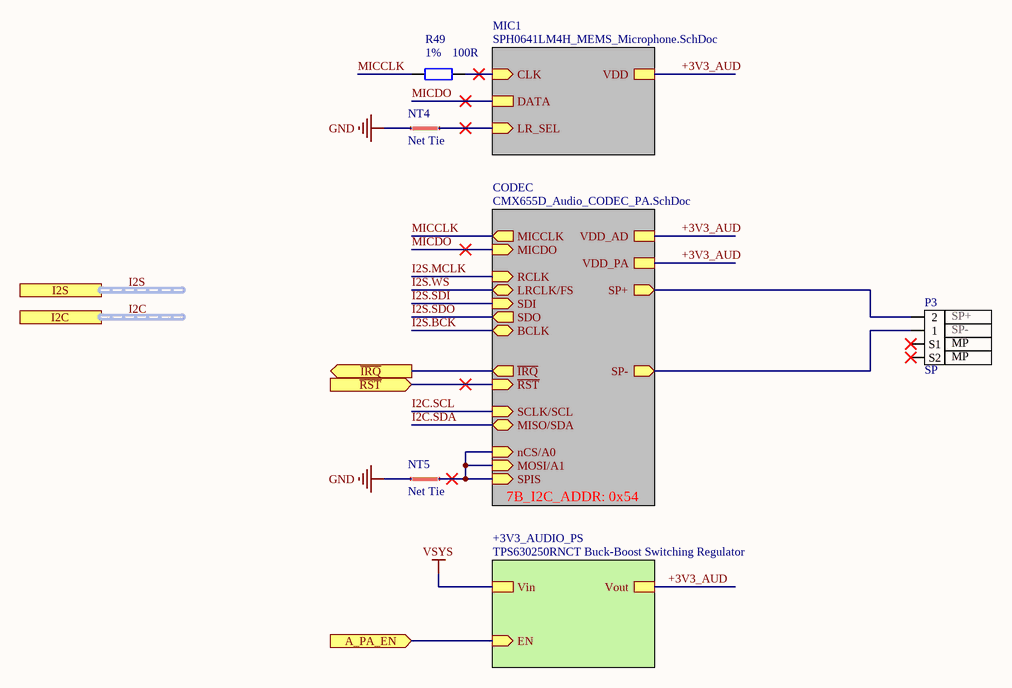
[diagram p3: Audio_Module.SchDoc]

### Parts
NT4  Net Tie  [Net Tie 6x30mil]  (net tie, no BOM)
NT5  Net Tie  [Net Tie 6x30mil]  (net tie, no BOM)
P3  SP  pin_1: SP+  pin_2: SP-  pin_MP1: MP  [CONN_JST_BM2B-SRSS-TB]
R49  Tolerance: 1%  Resistance: 100R  [R0402]  (hidden comment: RES SMD 100 OHM 1% 1/16W 0402)

### Sub-sheets
+3V3_AUDIO_PS = TPS630250RNCT Buck-Boost Switching Regulator (file not in this document): Vout, Vin, EN (in)
CODEC = CMX655D_Audio_CODEC_PA.SchDoc (file not in this document): SP+ (out), SP- (out), VDD_AD, VDD_PA, MICCLK (out), MICDO (in), ~{IRQ} (out), ~{RST} (in), SCLK/SCL (in), MISO/SDA (bidir), MOSI/A1 (in), nCS/A0 (in), SPIS (in), RCLK (in), LRCLK/FS (bidir), SDI (in), SDO (out), BCLK (bidir)  | 7B_I2C_ADDR: 0x54
MIC1 = SPH0641LM4H_MEMS_Microphone.SchDoc (file not in this document): CLK (in), DATA, VDD, LR_SEL (in)

### Ports
A_PA_EN (in), I2C (harness I2C), I2S (harness I2S), ~{IRQ} (out), ~{RST} (in)

### Nets
GND: NT4.1 NT5.1
+3V3_AUD: sheet MIC1/VDD, sheet CODEC/VDD_AD, sheet CODEC/VDD_PA, sheet +3V3_AUDIO_PS/Vout
I2C.SCL: sheet CODEC/SCLK/SCL
I2C.SDA: sheet CODEC/MISO/SDA
I2S.BCK: sheet CODEC/BCLK
I2S.MCLK: sheet CODEC/RCLK
I2S.SDI: sheet CODEC/SDI
I2S.SDO: sheet CODEC/SDO
I2S.WS: sheet CODEC/LRCLK/FS
MICCLK: R49.2 ; sheet CODEC/MICCLK
MICDO: sheet MIC1/DATA, sheet CODEC/MICDO
NetNT4_2: NT4.2 ; sheet MIC1/LR_SEL
NetNT5_2: NT5.2 ; sheet CODEC/MOSI/A1, sheet CODEC/nCS/A0, sheet CODEC/SPIS
NetP3_1: P3.1 ; sheet CODEC/SP-
NetP3_2: P3.2 ; sheet CODEC/SP+
NetR49_1: R49.1 ; sheet MIC1/CLK
(unnamed): port ~{RST}, sheet CODEC/~{RST}
(unnamed): port ~{IRQ}, sheet CODEC/~{IRQ}
(unnamed): port A_PA_EN, sheet +3V3_AUDIO_PS/EN

Not connected (* = marked no-connect by the designer): P3 S1* S2*

### Buses and harness runs
harness I2C = port I2C
harness I2S = port I2S

### Notes on the sheet
- Title
- Size:
- Date:
- A4
- Number:
- Time:
- Revision:
- Sheet
- of
- File:

### Library data of the parts
NT4 NT5 = Net Tie Line: ClassName: Net Tie
P3 = CONN HEADER SMD 2POS 1MM: Connector Header Surface Mount 2 position 0.039" (1.00mm); Manufacturer: JST; Manufacturer Part Number: BM02B-SRSS-TB(LF)(SN); Number of Positions: 2; Gender: Male; Current Rating: 1A; Contact Resistance: 30mR; Voltage Rating: 50V; Pitch: 1mm; Supplier 1: Digi-Key; Stock 1: 136465; Pricing 1: 1=0.51, 10=0.481, 100=0.3688, 500=0.3207 (USD); Mount: Surface Mount; Contact Plating: Tin,Copper; Contact Material: Brass,Tin; Color: Natural; Housing Color: Beige; Housing Material: Polyamide; Min Operating Temperature: -25°C; Max Operating Temperature: 85°C; Termination: Solder; Number of Rows: 1; Packaging: Tape and Reel; Fastening Type: Detent; Number of Contacts: 2; Connector Type: Header; Orientation: Right Angle; Max Current Rating: 1A; Max Voltage Rating (AC): 50V; Lead Free: Lead Free; Flammability Rating: UL94 V-0; ComponentLink1URL: https://www.digikey.com/en/products/detail/jst-sales-america-inc/BM02B-SRSS-TB-LF-SN/926694; ComponentLink1Description: https://www.digikey.com/en/products/detail/jst-sales-america-inc/BM02B-SRSS-TB-LF-SN/926694; Supplier Part Number 1: 455-1788-2-ND; Contact Shape: Circular; Insulation Material: Nylon; Insulation Color: Natural; Contact Finish - Mating: TIN; Series: BM02B-SR; Contact Type: Male Pin; Max Voltage Rating (DC): 50V; pin_MP2: MP
R49 = RES SMD 100 OHM 1% 1/16W 0402: 100 Ohms ±1% 0.063W, 1/16W Chip Resistor 0402 (1005 Metric) Moisture Resistant Thick Film; Manufacturer: Yageo; Manufacturer Part Number: RC0402FR-07100RL; Power Rating: 62.5mW; Voltage Rating: 50V; Temperature Coefficient: 100ppm/°C; Supplier 1: Digi-Key; Stock 1: 16989760; Pricing 1: 1=0.1, 10=0.016, 100=0.0064, 1000=0.0029, 2500=0.0025, 5000=0.0021 (USD); Case/Package: 0402; Number of Pins: 2; Case Code (Imperial): 0402; Case Code (Metric): 1005; Min Operating Temperature: -55°C; Max Operating Temperature: 155°C; Voltage Rating (DC): 50V; Packaging: Tape and Reel; Termination: SMD/SMT; Composition: Thick Film; Military Standard: Not; Length: 1mm; Height: 0.32mm; Width: 0.5mm; Depth: 0.5mm; REACH SVHC: No SVHC; Lead Free: Lead Free; ComponentLink1URL: http://www.farnell.com/datasheets/2167052.pdf?src-supplier=Element14; ComponentLink1Description: http://www.farnell.com/datasheets/2167052.pdf?src-supplier=Element14; ComponentLink2URL: http://www.yageo.com/documents/recent/PYu-RC_Group_51_RoHS_L_9.pdf?src-supplier=Mouser; ComponentLink2Description: http://www.yageo.com/documents/recent/PYu-RC_Group_51_RoHS_L_9.pdf?src-supplier=Mouser; ComponentLink3URL: http://www.yageo.com/documents/recent/PYu-RC0402_51_RoHS_L_6_r.pdf?src-supplier=Future+Electronics; ComponentLink3Description: http://www.yageo.com/documents/recent/PYu-RC0402_51_RoHS_L_6_r.pdf?src-supplier=Future+Electronics; ComponentLink4URL: https://www.verical.com/server-webapp/html/getDatasheet?partID=329466&src-supplier=Verical; ComponentLink4Description: https://www.verical.com/server-webapp/html/getDatasheet?partID=329466&src-supplier=Verical; ComponentLink5URL: http://www.farnell.com/datasheets/1018594.pdf?src-supplier=Element14; ComponentLink5Description: http://www.farnell.com/datasheets/1018594.pdf?src-supplier=Element14; ComponentLink6URL: http://documents.rs-components.com/techlib://itc_doclist_GB.htm?stockno=6185810&src-supplier=RSComponents; ComponentLink6Description: http://documents.rs-components.com/techlib://itc_doclist_GB.htm?stockno=6185810&src-supplier=RSComponents; Supplier Part Number 1: 311-100LRDKR-ND

## Sheet Test_Points.SchDoc: Test Points
size A4; DocumentNumber: 22; SheetNumber: 22; SheetTotal: 51
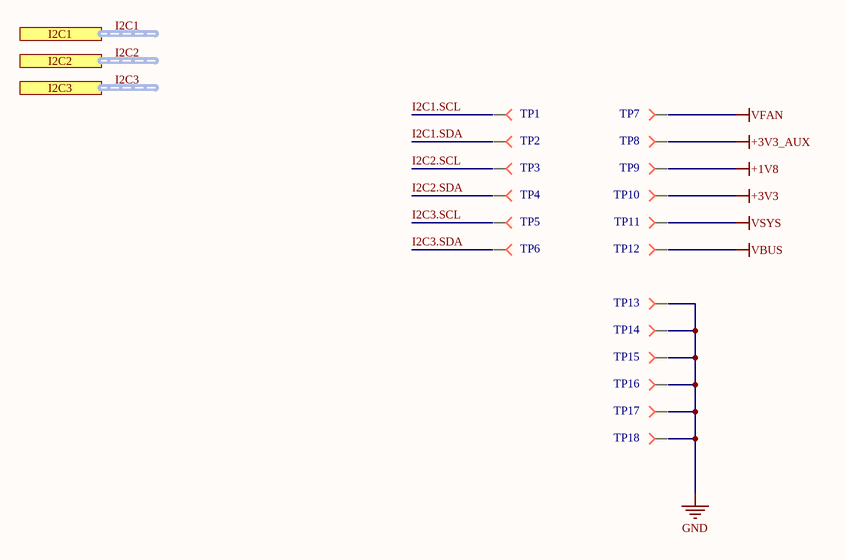
[diagram p4: Test_Points.SchDoc]

### Parts
TP1  Test Point Pad  [Testpoint]  (value not drawn)  (no BOM)
TP2  Test Point Pad  [Testpoint]  (value not drawn)  (no BOM)
TP3  Test Point Pad  [Testpoint]  (value not drawn)  (no BOM)
TP4  Test Point Pad  [Testpoint]  (value not drawn)  (no BOM)
TP5  Test Point Pad  [Testpoint]  (value not drawn)  (no BOM)
TP6  Test Point Pad  [Testpoint]  (value not drawn)  (no BOM)
TP7  Test Point Pad  [Testpoint]  (value not drawn)  (no BOM)
TP8  Test Point Pad  [Testpoint]  (value not drawn)  (no BOM)
TP9  Test Point Pad  [Testpoint]  (value not drawn)  (no BOM)
TP10  Test Point Pad  [Testpoint]  (value not drawn)  (no BOM)
TP11  Test Point Pad  [Testpoint]  (value not drawn)  (no BOM)
TP12  Test Point Pad  [Testpoint]  (value not drawn)  (no BOM)
TP13  Test Point Pad  [Testpoint]  (value not drawn)  (no BOM)
TP14  Test Point Pad  [Testpoint]  (value not drawn)  (no BOM)
TP15  Test Point Pad  [Testpoint]  (value not drawn)  (no BOM)
TP16  Test Point Pad  [Testpoint]  (value not drawn)  (no BOM)
TP17  Test Point Pad  [Testpoint]  (value not drawn)  (no BOM)
TP18  Test Point Pad  [Testpoint]  (value not drawn)  (no BOM)

### Ports
I2C1 (harness I2C), I2C2 (harness I2C), I2C3 (harness I2C)

### Nets
+1V8: TP9.1
+3V3: TP10.1
+3V3_AUX: TP8.1
GND: TP13.1 TP14.1 TP15.1 TP16.1 TP17.1 TP18.1
VBUS: TP12.1
VFAN: TP7.1
VSYS: TP11.1
I2C1.SCL: TP1.1
I2C1.SDA: TP2.1
I2C2.SCL: TP3.1
I2C2.SDA: TP4.1
I2C3.SCL: TP5.1
I2C3.SDA: TP6.1

### Buses and harness runs
harness I2C1 = port I2C1
harness I2C2 = port I2C2
harness I2C3 = port I2C3

### Notes on the sheet
- Title
- Size:
- Date:
- A4
- Number:
- Time:
- Revision:
- Sheet
- of
- File:

### Library data of the parts
TP1-TP18 = Test Point Pad: Test Point. There is nothing to buy or mount.; ClassName: TestPoint; CompType: TestPoint; Manufacturer: N/A; MountType: N/A; PackageReference: TetsPoint; PartNumber: N/A